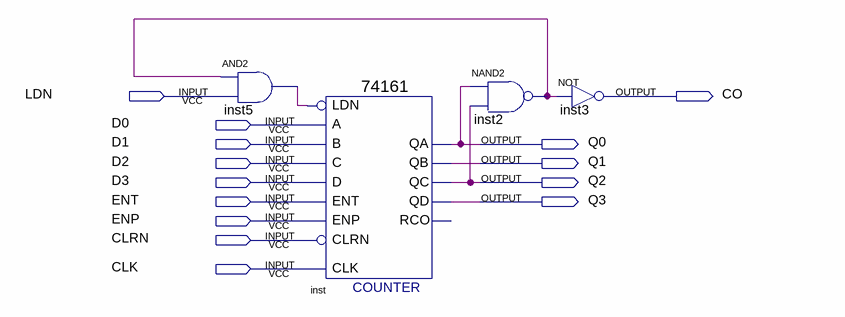
[diagram p0: schematic sheet]
// Quartus schematic count6.bdf as structural Verilog: 4 symbols, 14 pins
module count6 (
  input  LDN,
  input  D0,
  input  D1,
  input  D2,
  input  D3,
  input  ENT,
  input  ENP,
  input  CLRN,
  input  CLK,
  output CO,
  output Q0,
  output Q1,
  output Q2,
  output Q3
);

  wire inst2_out, inst5_out;

  and inst5 (inst5_out, inst2_out, LDN);
  \74161  inst (
    .CLRN(CLRN), .CLK(CLK), .ENP(ENP), .LDN(inst5_out), .A(D0), .D(D3), .ENT(ENT), .B(D1), .C(D2), .QD(Q3),
    .QC(Q2), .QB(Q1), .QA(Q0));  // open: RCO
  nand inst2 (inst2_out, Q0, Q2);
  not inst3 (CO, inst2_out);
endmodule
